# Altium schematic sheet Sch_door_key.SchDoc
size A; SheetNumber: 1; SheetTotal: 1
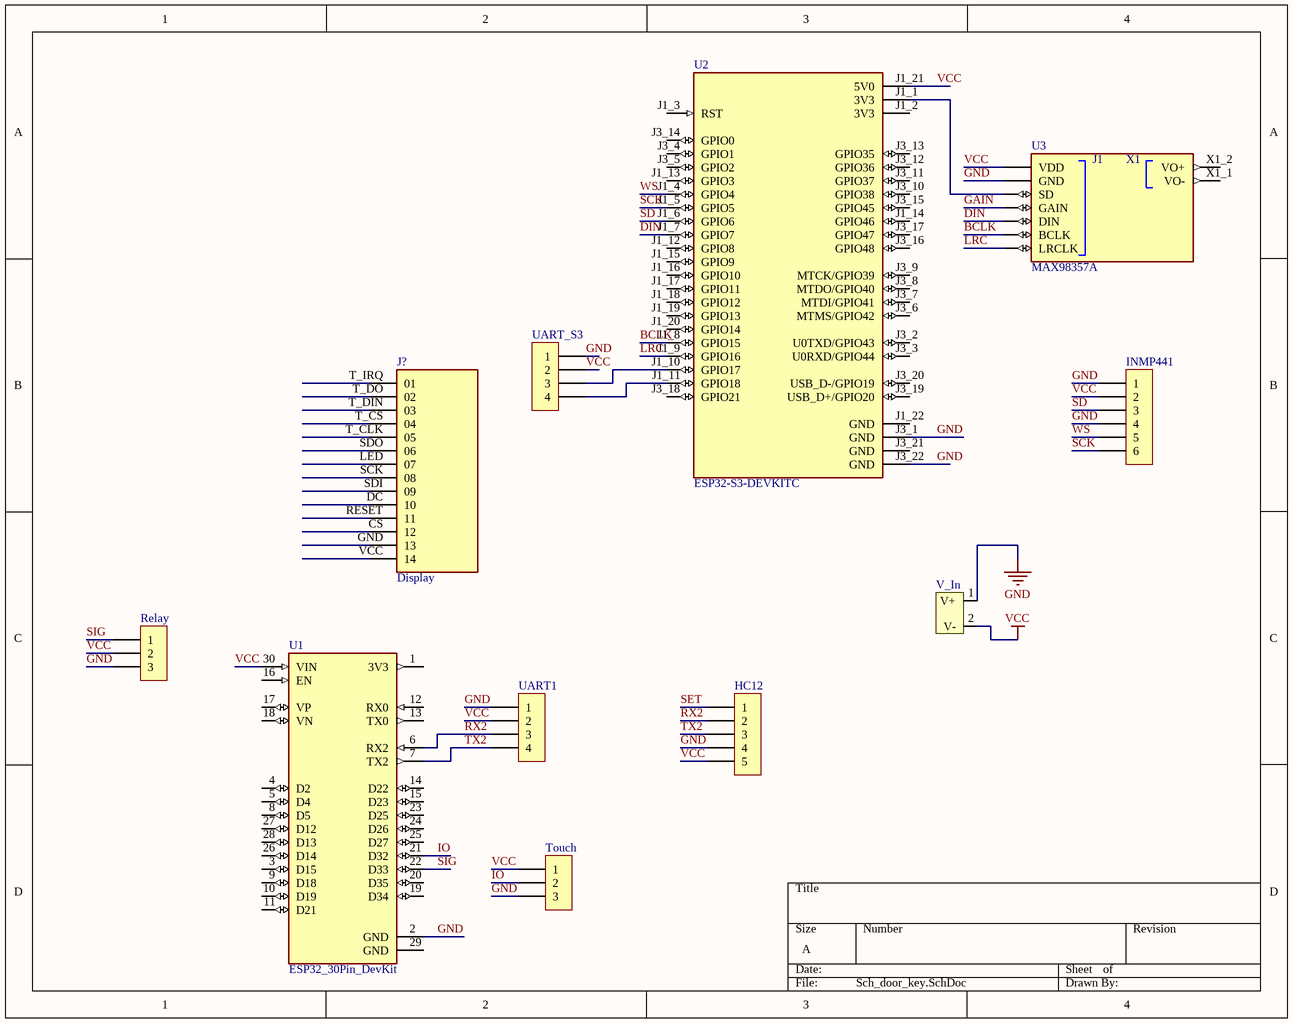
[diagram p0: Sch_door_key.SchDoc]

## Parts
HC12  HC-12  [XH2.54M-5]  (value not drawn)
INMP441  INMP441  [XH2.54M-6]  (value not drawn)
J?  Display  [SAMTEC_TSW-114-07-L-S-LL]
Relay  Servo  [XH2.54M-3]  (value not drawn)
Touch  IR_Receive  [XH2.54M-3]  (value not drawn)
U1  ESP32_30Pin_DevKit  [MODULE_ESP32_DEVKIT_V1]
U2  ESP32-S3-DEVKITC  [ESP32_S3_DEV_KIT]
U3  MAX98357A  [MAX98357]
UART1  UART1  [Header 4P DC 2.54]  (value not drawn)
UART_S3  UART_S3  [Header 4P DC 2.54]  (value not drawn)
V_In  V_In  [header_2_power]  (value not drawn)

## Nets
GND: HC12.4 INMP441.1 INMP441.4 Relay.3 Touch.3 U1.2(GND) U2.J3_1(GND) U2.J3_22(GND) U3.2(GND) UART1.1 UART_S3.1 V_In.1(V+)
VCC: HC12.5 INMP441.2 Relay.2 Touch.1 U1.30(VIN) U2.J1_21(5V0) U3.1(VDD) UART1.2 UART_S3.2 V_In.2(V-)
BCLK: U2.J1_8(GPIO15) U3.6(BCLK)
DIN: U2.J1_7(GPIO7) U3.5(DIN)
GAIN: U3.4(GAIN)
IO: Touch.2 U1.21(D32)
LRC: U2.J1_9(GPIO16) U3.7(LRCLK)
RX2: HC12.2 U1.6(RX2) UART1.3
SCK: INMP441.6 U2.J1_5(GPIO5)
SD: INMP441.3 U2.J1_6(GPIO6)
SET: HC12.1
SIG: Relay.1 U1.22(D33)
TX2: HC12.3 U1.7(TX2) UART1.4
WS: INMP441.5 U2.J1_4(GPIO4)
NetU2_J1_1: U2.J1_1(3V3) U3.3(SD)
NetU2_J1_10: U2.J1_10(GPIO17) UART_S3.3
NetU2_J1_11: U2.J1_11(GPIO18) UART_S3.4

Not connected (* = marked no-connect by the designer): J? CS(12) DC(10) GND(13) LED(07) RESET(11) SCK(08) SDI(09) SDO(06) T_CLK(05) T_CS(04) T_DIN(03) T_DO(02) T_IRQ(01) VCC(14); U1 1(3V3) 3(D15) 4(D2) 5(D4) 8(D5) 9(D18) 10(D19) 11(D21) 12(RX0) 13(TX0) 14(D22) 15(D23) 16(EN) 17(VP) 18(VN) 19(D34) 20(D35) 23(D25) 24(D26) 25(D27) 26(D14) 27(D12) 28(D13) 29(GND); U2 J1_2(3V3) J1_3(RST) J1_12(GPIO8) J1_13(GPIO3) J1_14(GPIO46) J1_15(GPIO9) J1_16(GPIO10) J1_17(GPIO11) J1_18(GPIO12) J1_19(GPIO13) J1_20(GPIO14) J1_22(GND) J3_2(U0TXD/GPIO43) J3_3(U0RXD/GPIO44) J3_4(GPIO1) J3_5(GPIO2) J3_6(MTMS/GPIO42) J3_7(MTDI/GPIO41) J3_8(MTDO/GPIO40) J3_9(MTCK/GPIO39) J3_10(GPIO38) J3_11(GPIO37) J3_12(GPIO36) J3_13(GPIO35) J3_14(GPIO0) J3_15(GPIO45) J3_16(GPIO48) J3_17(GPIO47) J3_18(GPIO21) J3_19(USB_D+/GPIO20) J3_20(USB_D-/GPIO19) J3_21(GND); U3 X1_1(VO-) X1_2(VO+)

## Notes on the sheet
- (in symbol MAX98357A) J1; X1

## Library data of the parts
HC12 = Header 5P 2.54 Duc Thang: Cắm; Ten_Linh_Kien: Header 5P XH2.54-5P Đực Thẳng; Don_Vi: Con; Ma_Hang: MH001298; Chung_Loai: Cắm
INMP441 = Header 6P 2.54 Duc Thang: Cắm; Ten_Linh_Kien: Header 6P XH2.54-6P Đực Thẳng; Don_Vi: Con; Ma_Hang: MH001972; Chung_Loai: Cắm
J? = TSW-114-07-L-S-LL: Package: None; Price: None; Value: *; MP: TSW-114-07-L-S-LL; Availability: Unavailable
Relay Touch = Header 3P 2.54 Duc Thang: Cắm; Ten_Linh_Kien: Header 3P XH2.54-3P Đực Thẳng; Don_Vi: Con; Ma_Hang: MH001292; Chung_Loai: Cắm
U1 = ESP32_30Pin_DevKit: Dual core, Wi-Fi: 2.4 GHz up to 150 Mbits/s,BLE (Bluetooth Low Energy) and legacy Bluetooth, 32 bits, Up to 240 MHz; MF: Do it; MP: ESP32-DEVKIT-V1; SnapEDA_Link: https://www.snapeda.com/parts/ESP32-DEVKIT-V1/Do+it/view-part/?ref=snap; Package: None; Value: *; Check_prices: https://www.snapeda.com/parts/ESP32-DEVKIT-V1/Do+it/view-part/?ref=eda
U2 = ESP32-S3-DEVKITC: The ESP32-S3-DEVKITC-1U-N8R8 from Espressif Systems is an evaluation board designed for wireless communication applications. It features a 32-bit Xtensa dual-core processor running at 240MHz, providing strong processing power for complex tasks. The board; SnapEDA_Link: https://www.snapeda.com/parts/ESP32-S3-DEVKITC-1U-N8R8/Espressif+Systems/view-part/?ref=snap; Package: None; Value: *; MF: Espressif Systems; MP: ESP32-S3-DEVKITC-1U-N8R8; Check_prices: https://www.snapeda.com/parts/ESP32-S3-DEVKITC-1U-N8R8/Espressif+Systems/view-part/?ref=eda
U3 = MAX98357A: MAX98357A - 1-Channel (Mono) Output Class D Audio Amplifier Evaluation Board; MF: Adafruit; MP: 3006; SnapEDA_Link: https://www.snapeda.com/parts/3006/Adafruit+Industries/view-part/?ref=snap; Package: Package; Value: *; Check_prices: https://www.snapeda.com/parts/3006/Adafruit+Industries/view-part/?ref=eda
UART1 UART_S3 = Header 4P 2.54 Duc Cong: Cắm; Ten_Linh_Kien: Header 4P XH2.54-4P Đực Cong; Don_Vi: Con; Ma_Hang: MH001310; Chung_Loai: Cắm
V_In = Header_2pin